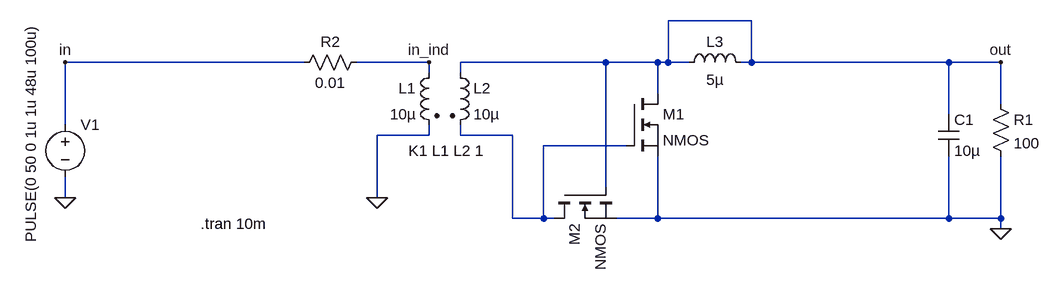
[diagram p0: schematic flyback-converter-2.asc]
flyback-converter-2.asc, the LTspice schematic file:
Version 4
SHEET 1 1092 680
WIRE 640 -32 512 -32
WIRE -48 32 -416 32
WIRE 144 32 32 32
WIRE 416 32 192 32
WIRE 496 32 416 32
WIRE 512 32 512 -32
WIRE 512 32 496 32
WIRE 544 32 512 32
WIRE 640 32 640 -32
WIRE 640 32 624 32
WIRE 944 32 640 32
WIRE 1024 32 944 32
WIRE 144 48 144 32
WIRE 192 48 192 32
WIRE 496 80 496 32
WIRE 1024 96 1024 32
WIRE 944 112 944 32
WIRE -416 128 -416 32
WIRE 144 144 144 128
WIRE 144 144 64 144
WIRE 192 144 192 128
WIRE 272 144 192 144
WIRE 448 160 320 160
WIRE 416 224 416 32
WIRE -416 240 -416 208
WIRE 64 240 64 144
WIRE 272 272 272 144
WIRE 320 272 320 160
WIRE 320 272 272 272
WIRE 336 272 320 272
WIRE 496 272 496 176
WIRE 496 272 432 272
WIRE 944 272 944 176
WIRE 944 272 496 272
WIRE 1024 272 1024 176
WIRE 1024 272 944 272
WIRE 1024 288 1024 272
FLAG -416 240 0
FLAG 64 240 0
FLAG -416 32 in
FLAG 1024 32 out
FLAG 1024 288 0
FLAG 144 32 in_ind
SYMBOL voltage -416 112 R0
WINDOW 123 0 0 Left 0
WINDOW 39 24 124 Left 2
WINDOW 3 -53 197 VLeft 2
SYMATTR InstName V1
SYMATTR Value PULSE(0 50 0 1u 1u 48u 100u)
SYMBOL ind2 160 32 M0
SYMATTR InstName L1
SYMATTR Value 10µ
SYMATTR Type ind
SYMBOL ind2 176 32 R0
SYMATTR InstName L2
SYMATTR Value 10µ
SYMATTR Type ind
SYMBOL res 1008 80 R0
SYMATTR InstName R1
SYMATTR Value 100
SYMBOL res 48 16 R90
WINDOW 0 0 56 VBottom 2
WINDOW 3 32 56 VTop 2
SYMATTR InstName R2
SYMATTR Value 0.01
SYMBOL cap 928 112 R0
SYMATTR InstName C1
SYMATTR Value 10µ
SYMBOL ind 528 48 R270
WINDOW 0 32 56 VTop 2
WINDOW 3 5 56 VBottom 2
SYMATTR InstName L3
SYMATTR Value 5µ
SYMBOL nmos 448 80 R0
SYMATTR InstName M1
SYMBOL nmos 336 224 M90
SYMATTR InstName M2
TEXT 112 168 Left 2 !K1 L1 L2 1
TEXT -208 280 Left 2 !.tran 10m

The netlist it stands for:
* flyback-converter-2.asc
V1 in 0 PULSE(0 50 0 1u 1u 48u 100u)
L1 in_ind 0 10µ
L2 out N001 10µ
R1 out 0 100
R2 in_ind in 0.01
C1 out 0 10µ
L3 out out 5µ
M1 out N001 0 0 NMOS
M2 N001 out 0 0 NMOS
.model NMOS NMOS
.model PMOS PMOS
.lib standard.mos
K1 L1 L2 1
.tran 10m
.backanno
.end